# Altium schematic sheet FPGA_HPCC_A_DPs.SchDoc: FPGA Differential Pairs for HPCC A
size B; CheckedBy: Jason Sullins; Author: Jordan Harris-Toovy; Revision: 0.2; SheetNumber: 18; SheetTotal: 22; Size: ANSI B
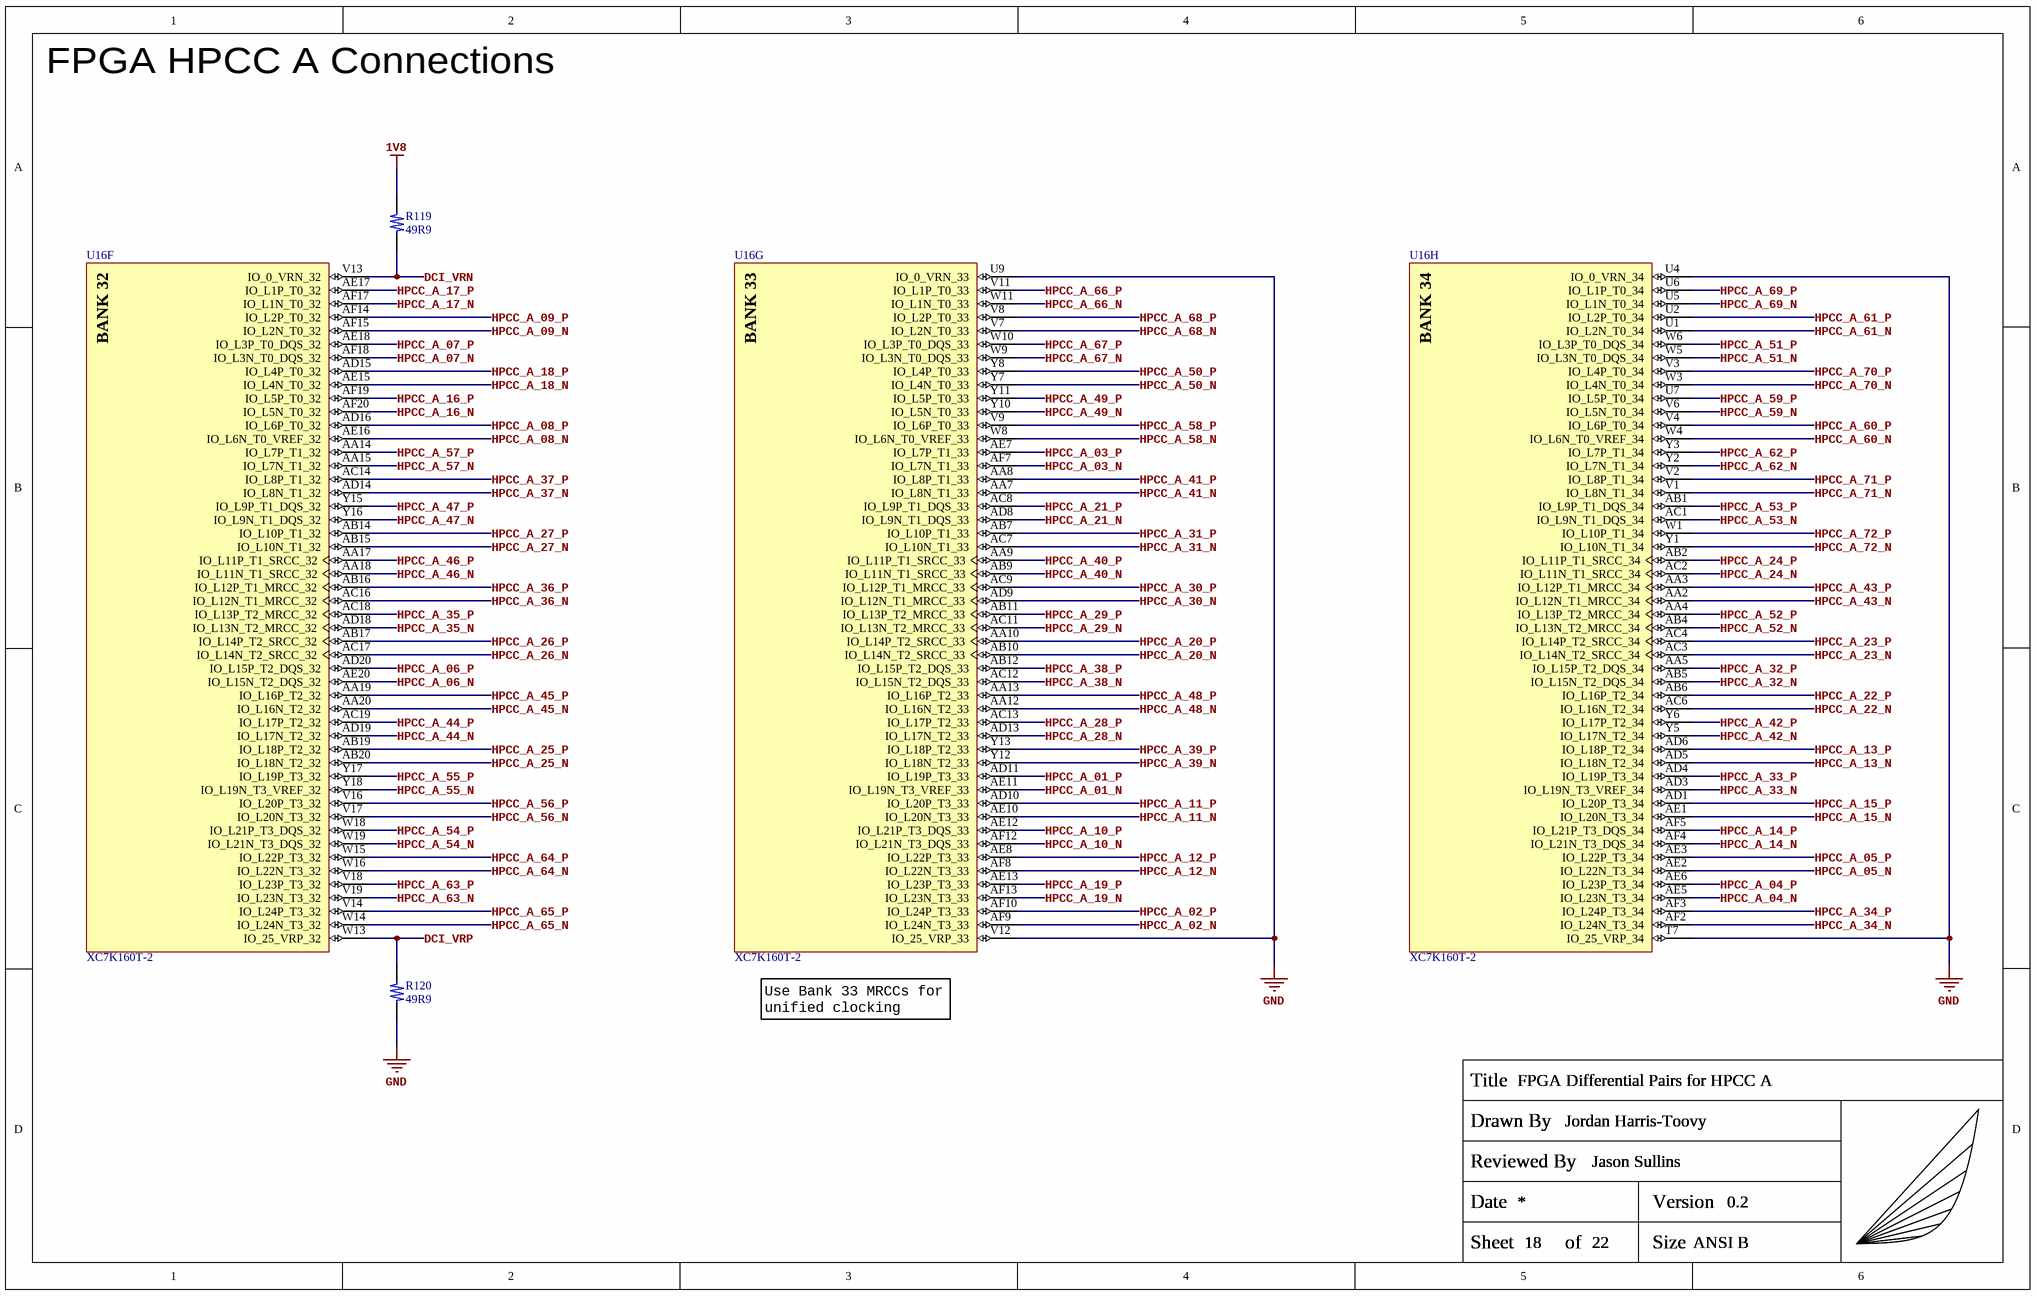
[diagram p0: FPGA_HPCC_A_DPs.SchDoc]

## Parts
R119  49R9  [R_0402_Generic]
R120  49R9  [R_0402_Generic]
TITLEBLOCK?  Capstone_Title_Block  (value not drawn)  (graphical)
U16  XC7K160T-2  [FFG676_(XC7K160T-2FFG676I)]  (parts F,G,H of 14)

## Nets
1V8: R119.2
GND: R120.1 U16.T7(IO_25_VRP_34) U16.U4(IO_0_VRN_34) U16.U9(IO_0_VRN_33) U16.V12(IO_25_VRP_33)
DCI_VRN: R119.1 U16.V13(IO_0_VRN_32)
DCI_VRP: R120.2 U16.W13(IO_25_VRP_32)
HPCC_A_01_N: U16.AE11(IO_L19N_T3_VREF_33)
HPCC_A_01_P: U16.AD11(IO_L19P_T3_33)
HPCC_A_02_N: U16.AF9(IO_L24N_T3_33)
HPCC_A_02_P: U16.AF10(IO_L24P_T3_33)
HPCC_A_03_N: U16.AF7(IO_L7N_T1_33)
HPCC_A_03_P: U16.AE7(IO_L7P_T1_33)
HPCC_A_04_N: U16.AE5(IO_L23N_T3_34)
HPCC_A_04_P: U16.AE6(IO_L23P_T3_34)
HPCC_A_05_N: U16.AE2(IO_L22N_T3_34)
HPCC_A_05_P: U16.AE3(IO_L22P_T3_34)
HPCC_A_06_N: U16.AE20(IO_L15N_T2_DQS_32)
HPCC_A_06_P: U16.AD20(IO_L15P_T2_DQS_32)
HPCC_A_07_N: U16.AF18(IO_L3N_T0_DQS_32)
HPCC_A_07_P: U16.AE18(IO_L3P_T0_DQS_32)
HPCC_A_08_N: U16.AE16(IO_L6N_T0_VREF_32)
HPCC_A_08_P: U16.AD16(IO_L6P_T0_32)
HPCC_A_09_N: U16.AF15(IO_L2N_T0_32)
HPCC_A_09_P: U16.AF14(IO_L2P_T0_32)
HPCC_A_10_N: U16.AF12(IO_L21N_T3_DQS_33)
HPCC_A_10_P: U16.AE12(IO_L21P_T3_DQS_33)
HPCC_A_11_N: U16.AE10(IO_L20N_T3_33)
HPCC_A_11_P: U16.AD10(IO_L20P_T3_33)
HPCC_A_12_N: U16.AF8(IO_L22N_T3_33)
HPCC_A_12_P: U16.AE8(IO_L22P_T3_33)
HPCC_A_13_N: U16.AD5(IO_L18N_T2_34)
HPCC_A_13_P: U16.AD6(IO_L18P_T2_34)
HPCC_A_14_N: U16.AF4(IO_L21N_T3_DQS_34)
HPCC_A_14_P: U16.AF5(IO_L21P_T3_DQS_34)
HPCC_A_15_N: U16.AE1(IO_L20N_T3_34)
HPCC_A_15_P: U16.AD1(IO_L20P_T3_34)
HPCC_A_16_N: U16.AF20(IO_L5N_T0_32)
HPCC_A_16_P: U16.AF19(IO_L5P_T0_32)
HPCC_A_17_N: U16.AF17(IO_L1N_T0_32)
HPCC_A_17_P: U16.AE17(IO_L1P_T0_32)
HPCC_A_18_N: U16.AE15(IO_L4N_T0_32)
HPCC_A_18_P: U16.AD15(IO_L4P_T0_32)
HPCC_A_19_N: U16.AF13(IO_L23N_T3_33)
HPCC_A_19_P: U16.AE13(IO_L23P_T3_33)
HPCC_A_20_N: U16.AB10(IO_L14N_T2_SRCC_33)
HPCC_A_20_P: U16.AA10(IO_L14P_T2_SRCC_33)
HPCC_A_21_N: U16.AD8(IO_L9N_T1_DQS_33)
HPCC_A_21_P: U16.AC8(IO_L9P_T1_DQS_33)
HPCC_A_22_N: U16.AC6(IO_L16N_T2_34)
HPCC_A_22_P: U16.AB6(IO_L16P_T2_34)
HPCC_A_23_N: U16.AC3(IO_L14N_T2_SRCC_34)
HPCC_A_23_P: U16.AC4(IO_L14P_T2_SRCC_34)
HPCC_A_24_N: U16.AC2(IO_L11N_T1_SRCC_34)
HPCC_A_24_P: U16.AB2(IO_L11P_T1_SRCC_34)
HPCC_A_25_N: U16.AB20(IO_L18N_T2_32)
HPCC_A_25_P: U16.AB19(IO_L18P_T2_32)
HPCC_A_26_N: U16.AC17(IO_L14N_T2_SRCC_32)
HPCC_A_26_P: U16.AB17(IO_L14P_T2_SRCC_32)
HPCC_A_27_N: U16.AB15(IO_L10N_T1_32)
HPCC_A_27_P: U16.AB14(IO_L10P_T1_32)
HPCC_A_28_N: U16.AD13(IO_L17N_T2_33)
HPCC_A_28_P: U16.AC13(IO_L17P_T2_33)
HPCC_A_29_N: U16.AC11(IO_L13N_T2_MRCC_33)
HPCC_A_29_P: U16.AB11(IO_L13P_T2_MRCC_33)
HPCC_A_30_N: U16.AD9(IO_L12N_T1_MRCC_33)
HPCC_A_30_P: U16.AC9(IO_L12P_T1_MRCC_33)
HPCC_A_31_N: U16.AC7(IO_L10N_T1_33)
HPCC_A_31_P: U16.AB7(IO_L10P_T1_33)
HPCC_A_32_N: U16.AB5(IO_L15N_T2_DQS_34)
HPCC_A_32_P: U16.AA5(IO_L15P_T2_DQS_34)
HPCC_A_33_N: U16.AD3(IO_L19N_T3_VREF_34)
HPCC_A_33_P: U16.AD4(IO_L19P_T3_34)
HPCC_A_34_N: U16.AF2(IO_L24N_T3_34)
HPCC_A_34_P: U16.AF3(IO_L24P_T3_34)
HPCC_A_35_N: U16.AD18(IO_L13N_T2_MRCC_32)
HPCC_A_35_P: U16.AC18(IO_L13P_T2_MRCC_32)
HPCC_A_36_N: U16.AC16(IO_L12N_T1_MRCC_32)
HPCC_A_36_P: U16.AB16(IO_L12P_T1_MRCC_32)
HPCC_A_37_N: U16.AD14(IO_L8N_T1_32)
HPCC_A_37_P: U16.AC14(IO_L8P_T1_32)
HPCC_A_38_N: U16.AC12(IO_L15N_T2_DQS_33)
HPCC_A_38_P: U16.AB12(IO_L15P_T2_DQS_33)
HPCC_A_39_N: U16.Y12(IO_L18N_T2_33)
HPCC_A_39_P: U16.Y13(IO_L18P_T2_33)
HPCC_A_40_N: U16.AB9(IO_L11N_T1_SRCC_33)
HPCC_A_40_P: U16.AA9(IO_L11P_T1_SRCC_33)
HPCC_A_41_N: U16.AA7(IO_L8N_T1_33)
HPCC_A_41_P: U16.AA8(IO_L8P_T1_33)
HPCC_A_42_N: U16.Y5(IO_L17N_T2_34)
HPCC_A_42_P: U16.Y6(IO_L17P_T2_34)
HPCC_A_43_N: U16.AA2(IO_L12N_T1_MRCC_34)
HPCC_A_43_P: U16.AA3(IO_L12P_T1_MRCC_34)
HPCC_A_44_N: U16.AD19(IO_L17N_T2_32)
HPCC_A_44_P: U16.AC19(IO_L17P_T2_32)
HPCC_A_45_N: U16.AA20(IO_L16N_T2_32)
HPCC_A_45_P: U16.AA19(IO_L16P_T2_32)
HPCC_A_46_N: U16.AA18(IO_L11N_T1_SRCC_32)
HPCC_A_46_P: U16.AA17(IO_L11P_T1_SRCC_32)
HPCC_A_47_N: U16.Y16(IO_L9N_T1_DQS_32)
HPCC_A_47_P: U16.Y15(IO_L9P_T1_DQS_32)
HPCC_A_48_N: U16.AA12(IO_L16N_T2_33)
HPCC_A_48_P: U16.AA13(IO_L16P_T2_33)
HPCC_A_49_N: U16.Y10(IO_L5N_T0_33)
HPCC_A_49_P: U16.Y11(IO_L5P_T0_33)
HPCC_A_50_N: U16.Y7(IO_L4N_T0_33)
HPCC_A_50_P: U16.Y8(IO_L4P_T0_33)
HPCC_A_51_N: U16.W5(IO_L3N_T0_DQS_34)
HPCC_A_51_P: U16.W6(IO_L3P_T0_DQS_34)
HPCC_A_52_N: U16.AB4(IO_L13N_T2_MRCC_34)
HPCC_A_52_P: U16.AA4(IO_L13P_T2_MRCC_34)
HPCC_A_53_N: U16.AC1(IO_L9N_T1_DQS_34)
HPCC_A_53_P: U16.AB1(IO_L9P_T1_DQS_34)
HPCC_A_54_N: U16.W19(IO_L21N_T3_DQS_32)
HPCC_A_54_P: U16.W18(IO_L21P_T3_DQS_32)
HPCC_A_55_N: U16.Y18(IO_L19N_T3_VREF_32)
HPCC_A_55_P: U16.Y17(IO_L19P_T3_32)
HPCC_A_56_N: U16.V17(IO_L20N_T3_32)
HPCC_A_56_P: U16.V16(IO_L20P_T3_32)
HPCC_A_57_N: U16.AA15(IO_L7N_T1_32)
HPCC_A_57_P: U16.AA14(IO_L7P_T1_32)
HPCC_A_58_N: U16.W8(IO_L6N_T0_VREF_33)
HPCC_A_58_P: U16.V9(IO_L6P_T0_33)
HPCC_A_59_N: U16.V6(IO_L5N_T0_34)
HPCC_A_59_P: U16.U7(IO_L5P_T0_34)
HPCC_A_60_N: U16.W4(IO_L6N_T0_VREF_34)
HPCC_A_60_P: U16.V4(IO_L6P_T0_34)
HPCC_A_61_N: U16.U1(IO_L2N_T0_34)
HPCC_A_61_P: U16.U2(IO_L2P_T0_34)
HPCC_A_62_N: U16.Y2(IO_L7N_T1_34)
HPCC_A_62_P: U16.Y3(IO_L7P_T1_34)
HPCC_A_63_N: U16.V19(IO_L23N_T3_32)
HPCC_A_63_P: U16.V18(IO_L23P_T3_32)
HPCC_A_64_N: U16.W16(IO_L22N_T3_32)
HPCC_A_64_P: U16.W15(IO_L22P_T3_32)
HPCC_A_65_N: U16.W14(IO_L24N_T3_32)
HPCC_A_65_P: U16.V14(IO_L24P_T3_32)
HPCC_A_66_N: U16.W11(IO_L1N_T0_33)
HPCC_A_66_P: U16.V11(IO_L1P_T0_33)
HPCC_A_67_N: U16.W9(IO_L3N_T0_DQS_33)
HPCC_A_67_P: U16.W10(IO_L3P_T0_DQS_33)
HPCC_A_68_N: U16.V7(IO_L2N_T0_33)
HPCC_A_68_P: U16.V8(IO_L2P_T0_33)
HPCC_A_69_N: U16.U5(IO_L1N_T0_34)
HPCC_A_69_P: U16.U6(IO_L1P_T0_34)
HPCC_A_70_N: U16.W3(IO_L4N_T0_34)
HPCC_A_70_P: U16.V3(IO_L4P_T0_34)
HPCC_A_71_N: U16.V1(IO_L8N_T1_34)
HPCC_A_71_P: U16.V2(IO_L8P_T1_34)
HPCC_A_72_N: U16.Y1(IO_L10N_T1_34)
HPCC_A_72_P: U16.W1(IO_L10P_T1_34)

## Notes on the sheet
- FPGA HPCC A Connections
- (near U16) Use Bank 33 MRCCs for unified clocking
- (in symbol Capstone_Title_Block) Title; Drawn By; Reviewed By; Date; Version; Sheet; of; Size
- (in symbol XC7K160T-2FFG676I, part F) BANK 32
- (in symbol XC7K160T-2FFG676I, part G) BANK 33
- (in symbol XC7K160T-2FFG676I, part H) BANK 34

## Library data of the parts
R119 R120 = ERJ-2RKD49R9X: 49.9Ohm 0.5% 1/16W SMD resistor in 0402 size; Manufacturer: Panasonic; Manufacturer Part Number: ERJ-2RKD49R9X
TITLEBLOCK? = Capstone_Title_Block: Custom title block with personal logo; Manufacturer: NONE; Manufacturer Part Number: NONE
U16 = XC7K160T-2FFG676I: Kintex-7 FPGA, 400 User I/Os, 8 GTX, 676-Ball BGA, Speed Grade 2, Industrial Grade, Pb-Free; Manufacturer: AMD/Xilinx; Manufacturer Part Number: XC7K160T-2FFG676I